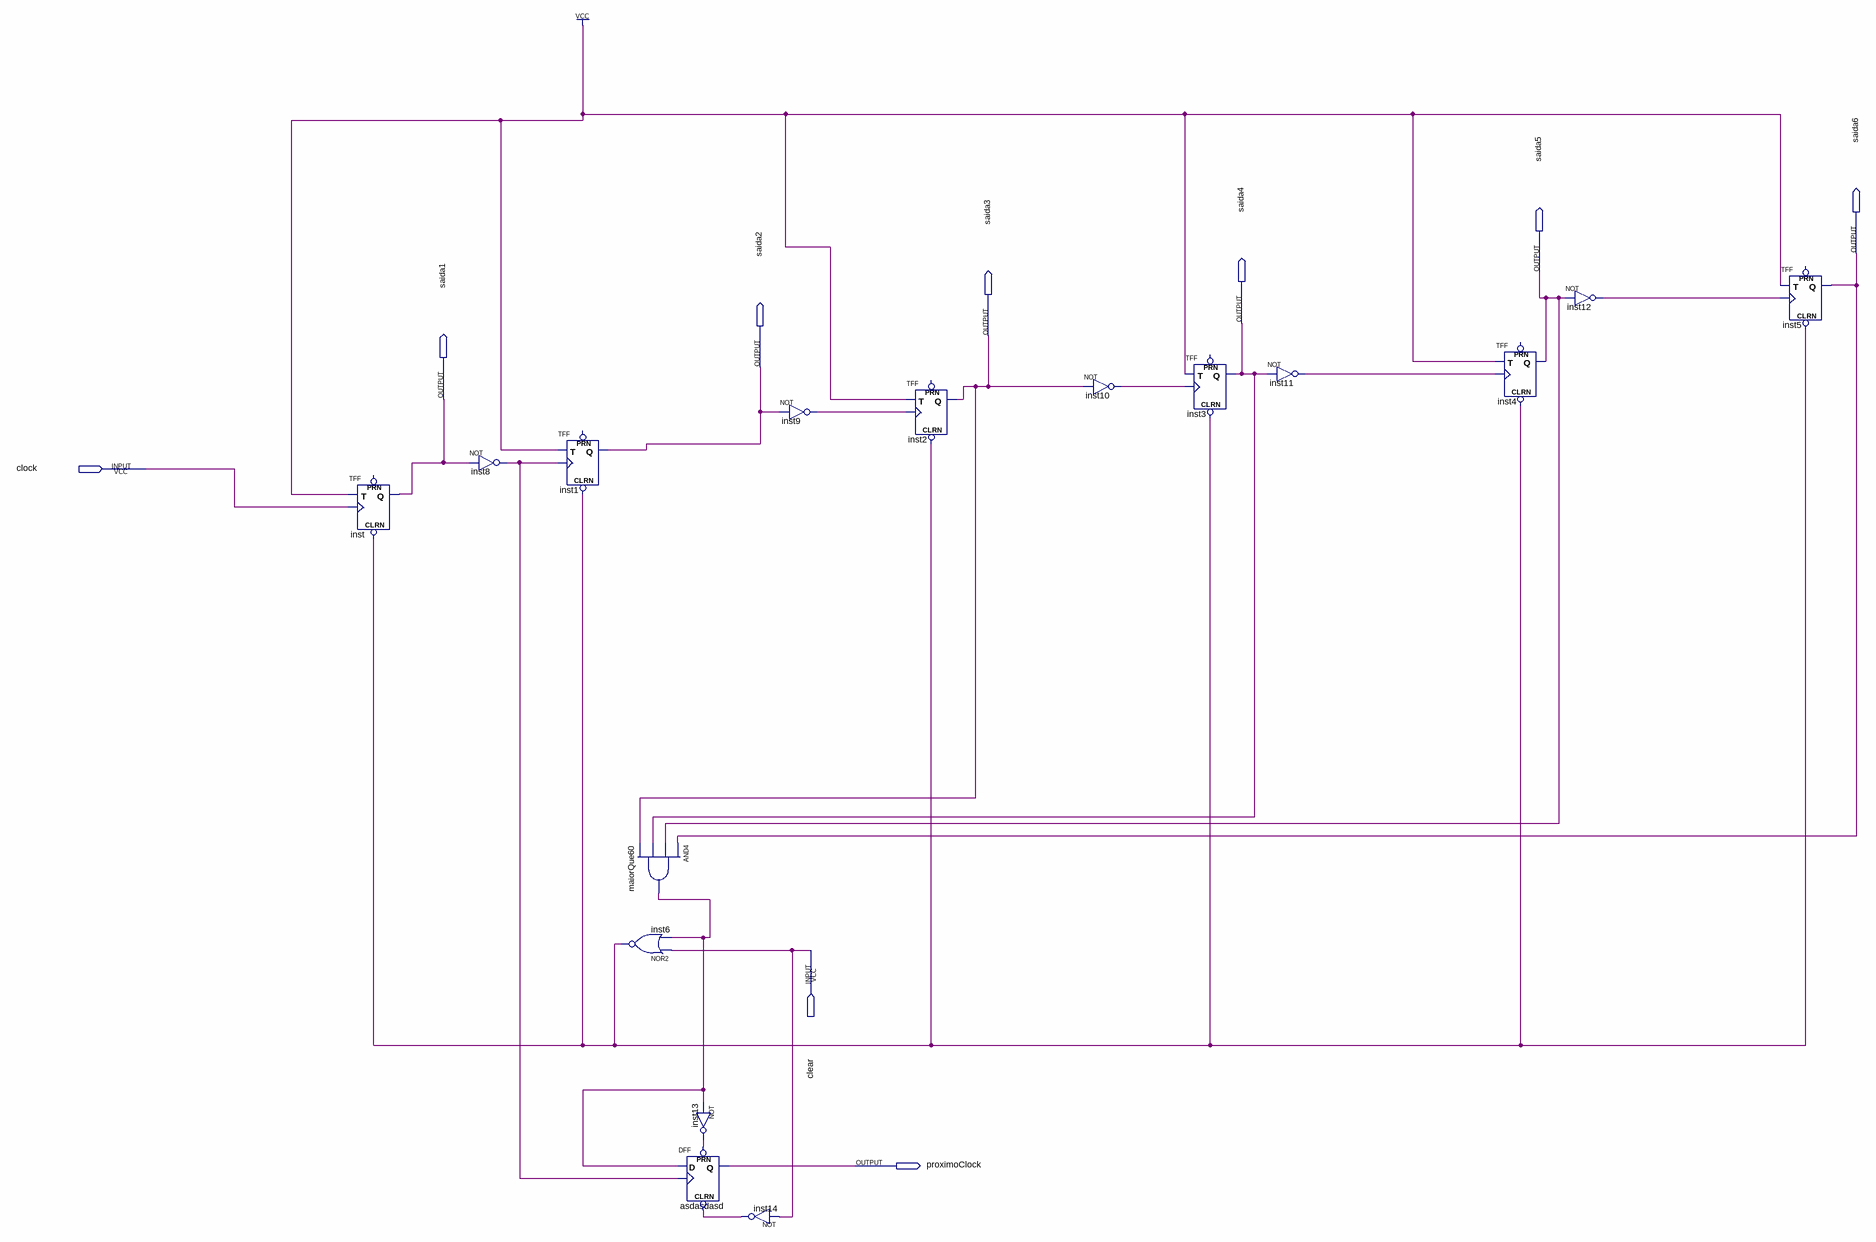
[diagram p0: schematic sheet]
// Quartus schematic ContadorDe0a60simples.bdf as structural Verilog: 16 symbols, 9 pins
module ContadorDe0a60simples (
  input  clock,
  input  clear,
  output saida6,
  output saida5,
  output saida4,
  output saida3,
  output saida2,
  output saida1,
  output proximoClock
);

  wire inst6_out, inst8_out, inst9_out, inst10_out, inst11_out, inst12_out, inst13_out, inst14_out,
       maiorQue60_out;

  TFF inst (.CLRN(inst6_out), .T(1'b1), .CLK(clock), .Q(saida1));  // open: PRN
  not inst8 (inst8_out, saida1);
  TFF inst1 (.CLRN(inst6_out), .T(1'b1), .CLK(inst8_out), .Q(saida2));  // open: PRN
  and maiorQue60 (maiorQue60_out, saida6, saida5, saida4, saida3);
  nor inst6 (inst6_out, clear, maiorQue60_out);
  not inst13 (inst13_out, maiorQue60_out);
  DFF asdasdasd (.CLRN(inst14_out), .CLK(inst8_out), .D(maiorQue60_out), .PRN(inst13_out), .Q(proximoClock));
  not inst14 (inst14_out, clear);
  not inst9 (inst9_out, saida2);
  TFF inst2 (.CLRN(inst6_out), .T(1'b1), .CLK(inst9_out), .Q(saida3));  // open: PRN
  not inst10 (inst10_out, saida3);
  TFF inst3 (.CLRN(inst6_out), .T(1'b1), .CLK(inst10_out), .Q(saida4));  // open: PRN
  not inst11 (inst11_out, saida4);
  TFF inst4 (.CLRN(inst6_out), .T(1'b1), .CLK(inst11_out), .Q(saida5));  // open: PRN
  not inst12 (inst12_out, saida5);
  TFF inst5 (.CLRN(inst6_out), .T(1'b1), .CLK(inst12_out), .Q(saida6));  // open: PRN
endmodule
